# EAGLE design untitled (EAGLE 7.7.0)
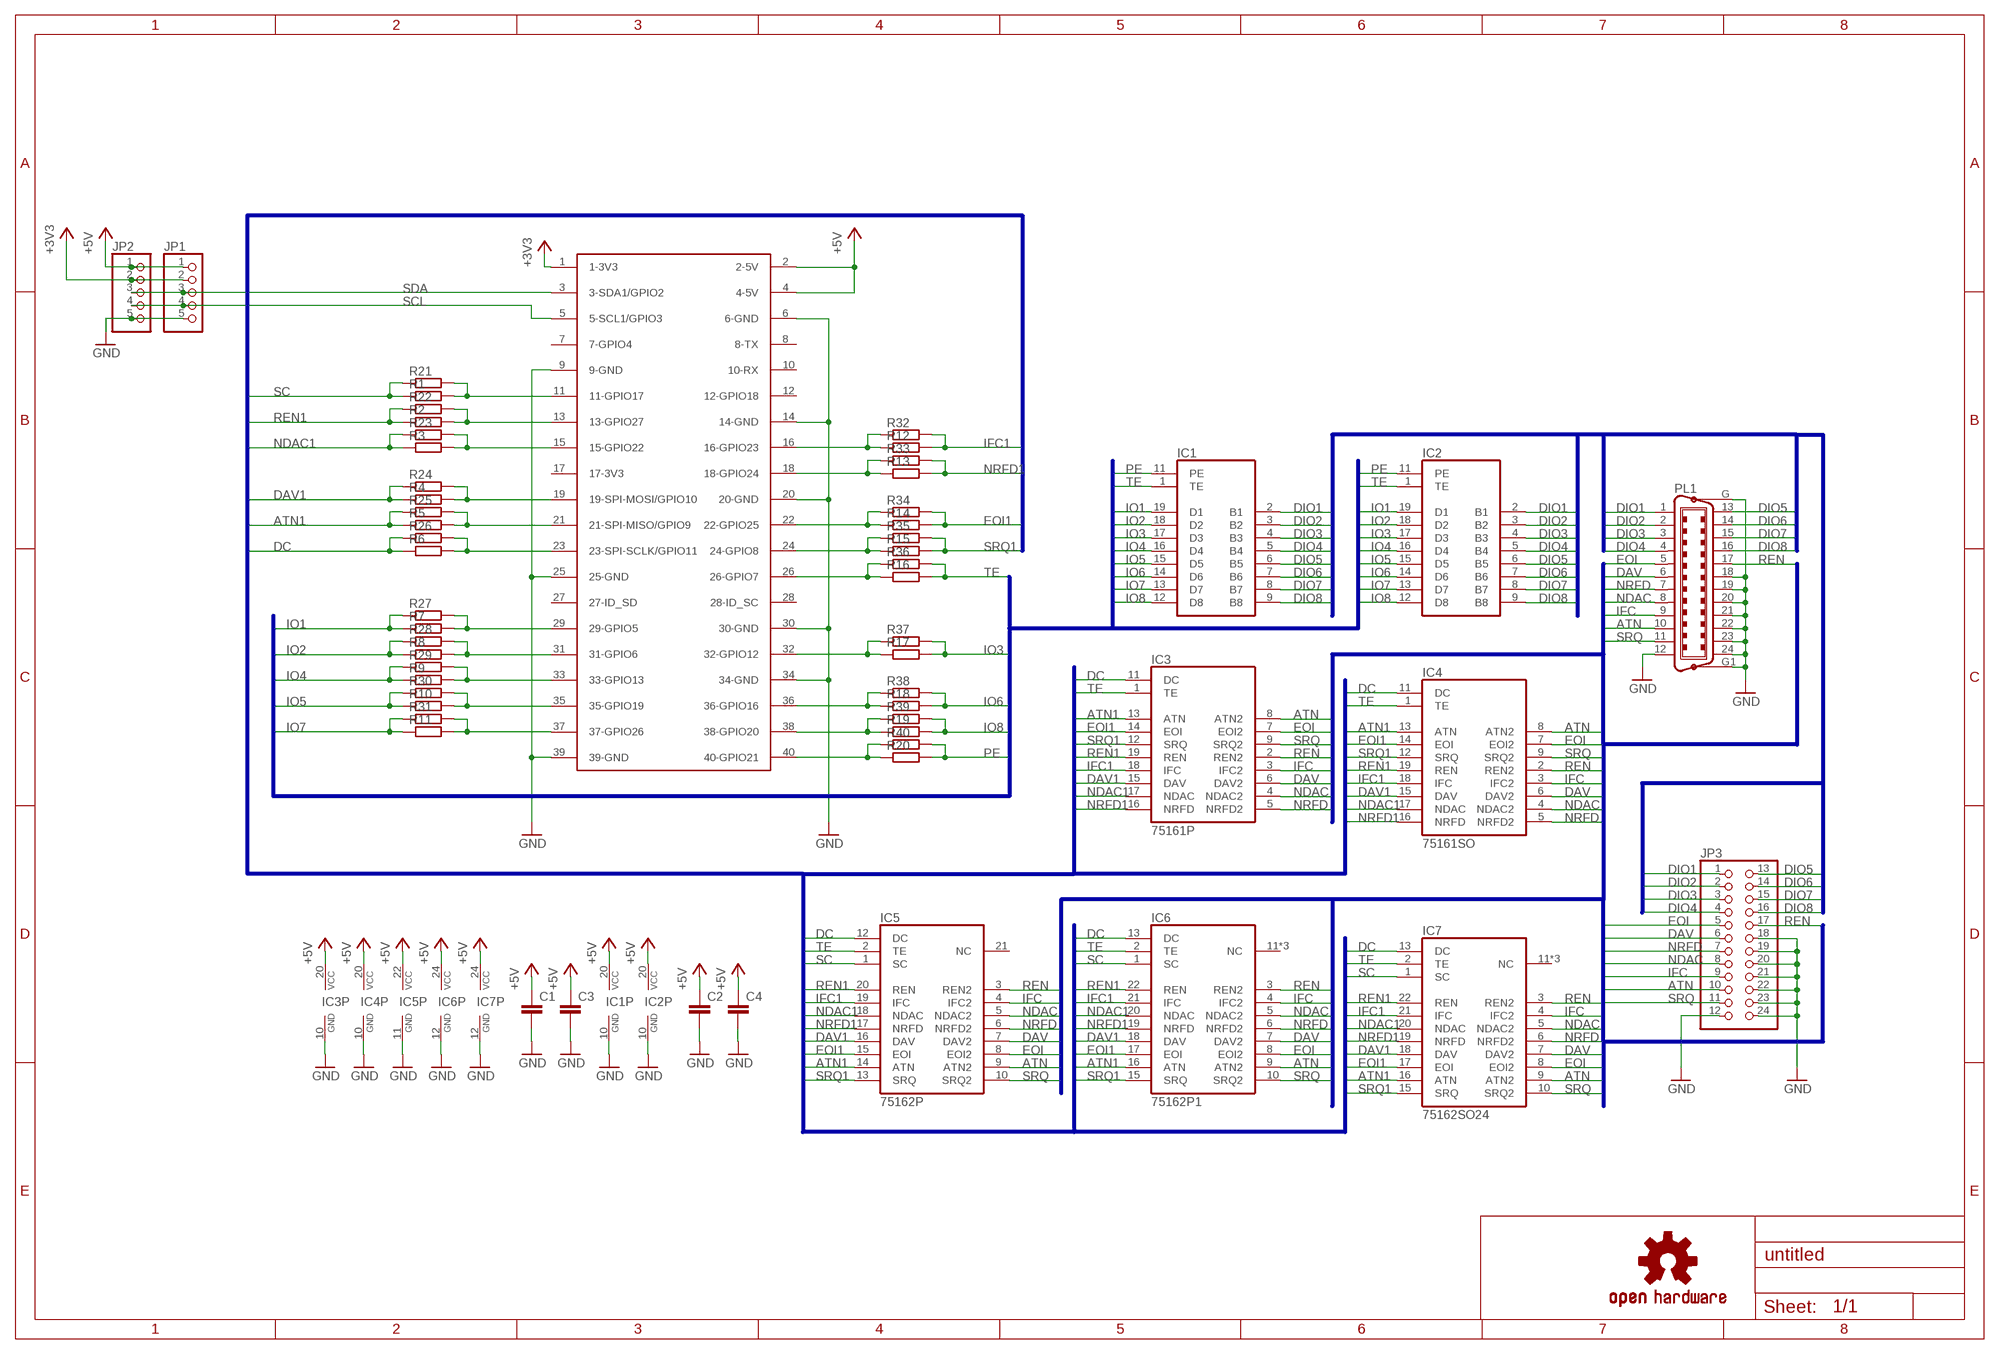
[diagram p0: schematic, sheet 1]

## Parts
C1  C-EUC0805  [C0805]
C2  C-EUC0805  [C0805]
C3  C-EU050-024X044  [C050-024X044]
C4  C-EU050-024X044  [C050-024X044]
IC1  75160P  [DIL20]
IC2  75160SO  [SO20L]
IC3  75161P  [DIL20]
IC4  75161SO  [SO20L]
IC5  75162P  [DIL22-3]
IC6  75162P1  [DIL24-3]
IC7  75162SO24  [SOIC127P1030X265-24N]
JP1  PINHD-1X5  [1X05]
JP2  PINHD-1X5  [1X05]
JP3  GPIB-PINHD-2X12  [GPIB-PINHD-2X12]
LOGO2  OSHW-LOGOS  [OSHW-LOGO-S]
PL1  C24HP  [24HP]
R1  R-EU_R0805  [R0805]
R2  R-EU_R0805  [R0805]
R3  R-EU_R0805  [R0805]
R4  R-EU_R0805  [R0805]
R5  R-EU_R0805  [R0805]
R6  R-EU_R0805  [R0805]
R7  R-EU_R0805  [R0805]
R8  R-EU_R0805  [R0805]
R9  R-EU_R0805  [R0805]
R10  R-EU_R0805  [R0805]
R11  R-EU_R0805  [R0805]
R12  R-EU_R0805  [R0805]
R13  R-EU_R0805  [R0805]
R14  R-EU_R0805  [R0805]
R15  R-EU_R0805  [R0805]
R16  R-EU_R0805  [R0805]
R17  R-EU_R0805  [R0805]
R18  R-EU_R0805  [R0805]
R19  R-EU_R0805  [R0805]
R20  R-EU_R0805  [R0805]
R21  R-EU_0204/7  [0204/7]
R22  R-EU_0204/7  [0204/7]
R23  R-EU_0204/7  [0204/7]
R24  R-EU_0204/7  [0204/7]
R25  R-EU_0204/7  [0204/7]
R26  R-EU_0204/7  [0204/7]
R27  R-EU_0204/7  [0204/7]
R28  R-EU_0204/7  [0204/7]
R29  R-EU_0204/7  [0204/7]
R30  R-EU_0204/7  [0204/7]
R31  R-EU_0204/7  [0204/7]
R32  R-EU_0204/7  [0204/7]
R33  R-EU_0204/7  [0204/7]
R34  R-EU_0204/7  [0204/7]
R35  R-EU_0204/7  [0204/7]
R36  R-EU_0204/7  [0204/7]
R37  R-EU_0204/7  [0204/7]
R38  R-EU_0204/7  [0204/7]
R39  R-EU_0204/7  [0204/7]
R40  R-EU_0204/7  [0204/7]
U$2  RASPBERRY-PI+HEADERONLY  [RASPBERRY-PI-PLUS-HEADERONLY]

## Nets
+3V3: JP1.2 JP2.2 U$2.1(1-3V3)
+5V: C1.1 C2.1 C3.1 C4.1 IC1.20(VCC) IC2.20(VCC) IC3.20(VCC) IC4.20(VCC) IC5.22(VCC) IC6.24(VCC) IC7.24(VCC) JP1.1 JP2.1 U$2.2(2-5V) U$2.4(4-5V)
ATN: IC3.8(ATN2) IC4.8(ATN2) IC5.9(ATN2) IC6.9(ATN2) IC7.9(ATN2) JP3.10 PL1.10
ATN1: IC3.13(ATN) IC4.13(ATN) IC5.14(ATN) IC6.16(ATN) IC7.16(ATN) R5.1 R25.1
DAV: IC3.6(DAV2) IC4.6(DAV2) IC5.7(DAV2) IC6.7(DAV2) IC7.7(DAV2) JP3.6 PL1.6
DAV1: IC3.15(DAV) IC4.15(DAV) IC5.16(DAV) IC6.18(DAV) IC7.18(DAV) R4.1 R24.1
DC: IC3.11(DC) IC4.11(DC) IC5.12(DC) IC6.13(DC) IC7.13(DC) R6.1 R26.1
DIO1: IC1.2(B1) IC2.2(B1) JP3.1 PL1.1
DIO2: IC1.3(B2) IC2.3(B2) JP3.2 PL1.2
DIO3: IC1.4(B3) IC2.4(B3) JP3.3 PL1.3
DIO4: IC1.5(B4) IC2.5(B4) JP3.4 PL1.4
DIO5: IC1.6(B5) IC2.6(B5) JP3.13 PL1.13
DIO6: IC1.7(B6) IC2.7(B6) JP3.14 PL1.14
DIO7: IC1.8(B7) IC2.8(B7) JP3.15 PL1.15
DIO8: IC1.9(B8) IC2.9(B8) JP3.16 PL1.16
EOI: IC3.7(EOI2) IC4.7(EOI2) IC5.8(EOI2) IC6.8(EOI2) IC7.8(EOI2) JP3.5 PL1.5
EOI1: IC3.14(EOI) IC4.14(EOI) IC5.15(EOI) IC6.17(EOI) IC7.17(EOI) R14.2 R34.2
GND: C1.2 C2.2 C3.2 C4.2 IC1.10(GND) IC2.10(GND) IC3.10(GND) IC4.10(GND) IC5.11(GND) IC6.12(GND) IC7.12(GND) JP1.5 JP2.5 JP3.12 JP3.18 JP3.19 JP3.20 JP3.21 JP3.22 JP3.23 JP3.24 PL1.12 PL1.18 PL1.19 PL1.20 PL1.21 PL1.22 PL1.23 PL1.24 PL1.G PL1.G1 U$2.6(6-GND) U$2.9(9-GND) U$2.14(14-GND) U$2.20(20-GND) U$2.25(25-GND) U$2.30(30-GND) U$2.34(34-GND) U$2.39(39-GND)
IFC: IC3.3(IFC2) IC4.3(IFC2) IC5.4(IFC2) IC6.4(IFC2) IC7.4(IFC2) JP3.9 PL1.9
IFC1: IC3.18(IFC) IC4.18(IFC) IC5.19(IFC) IC6.21(IFC) IC7.21(IFC) R12.2 R32.2
IO1: IC1.19(D1) IC2.19(D1) R7.1 R27.1
IO2: IC1.18(D2) IC2.18(D2) R8.1 R28.1
IO3: IC1.17(D3) IC2.17(D3) R17.2 R37.2
IO4: IC1.16(D4) IC2.16(D4) R9.1 R29.1
IO5: IC1.15(D5) IC2.15(D5) R10.1 R30.1
IO6: IC1.14(D6) IC2.14(D6) R18.2 R38.2
IO7: IC1.13(D7) IC2.13(D7) R11.1 R31.1
IO8: IC1.12(D8) IC2.12(D8) R19.2 R39.2
N$1: R1.2 R21.2 U$2.11(11-GPIO17)
N$2: R2.2 R22.2 U$2.13(13-GPIO27)
N$3: R3.2 R23.2 U$2.15(15-GPIO22)
N$4: R4.2 R24.2 U$2.19(19-SPI-MOSI/GPIO10)
N$5: R5.2 R25.2 U$2.21(21-SPI-MISO/GPIO9)
N$6: R6.2 R26.2 U$2.23(23-SPI-SCLK/GPIO11)
N$7: R7.2 R27.2 U$2.29(29-GPIO5)
N$8: R8.2 R28.2 U$2.31(31-GPIO6)
N$9: R9.2 R29.2 U$2.33(33-GPIO13)
N$10: R10.2 R30.2 U$2.35(35-GPIO19)
N$11: R11.2 R31.2 U$2.37(37-GPIO26)
N$12: R12.1 R32.1 U$2.16(16-GPIO23)
N$13: R13.1 R33.1 U$2.18(18-GPIO24)
N$14: R14.1 R34.1 U$2.22(22-GPIO25)
N$15: R15.1 R35.1 U$2.24(24-GPIO8)
N$16: R16.1 R36.1 U$2.26(26-GPIO7)
N$17: R17.1 R37.1 U$2.32(32-GPIO12)
N$18: R18.1 R38.1 U$2.36(36-GPIO16)
N$19: R19.1 R39.1 U$2.38(38-GPIO20)
N$20: R20.1 R40.1 U$2.40(40-GPIO21)
NDAC: IC3.4(NDAC2) IC4.4(NDAC2) IC5.5(NDAC2) IC6.5(NDAC2) IC7.5(NDAC2) JP3.8 PL1.8
NDAC1: IC3.17(NDAC) IC4.17(NDAC) IC5.18(NDAC) IC6.20(NDAC) IC7.20(NDAC) R3.1 R23.1
NRFD: IC3.5(NRFD2) IC4.5(NRFD2) IC5.6(NRFD2) IC6.6(NRFD2) IC7.6(NRFD2) JP3.7 PL1.7
NRFD1: IC3.16(NRFD) IC4.16(NRFD) IC5.17(NRFD) IC6.19(NRFD) IC7.19(NRFD) R13.2 R33.2
PE: IC1.11(PE) IC2.11(PE) R20.2 R40.2
REN: IC3.2(REN2) IC4.2(REN2) IC5.3(REN2) IC6.3(REN2) IC7.3(REN2) JP3.17 PL1.17
REN1: IC3.19(REN) IC4.19(REN) IC5.20(REN) IC6.22(REN) IC7.22(REN) R2.1 R22.1
SC: IC5.1(SC) IC6.1(SC) IC7.1(SC) R1.1 R21.1
SCL: JP1.4 JP2.4 U$2.5(5-SCL1/GPIO3)
SDA: JP1.3 JP2.3 U$2.3(3-SDA1/GPIO2)
SRQ: IC3.9(SRQ2) IC4.9(SRQ2) IC5.10(SRQ2) IC6.10(SRQ2) IC7.10(SRQ2) JP3.11 PL1.11
SRQ1: IC3.12(SRQ) IC4.12(SRQ) IC5.13(SRQ) IC6.15(SRQ) IC7.15(SRQ) R15.2 R35.2
TE: IC1.1(TE) IC2.1(TE) IC3.1(TE) IC4.1(TE) IC5.2(TE) IC6.2(TE) IC7.2(TE) R16.2 R36.2
Unconnected: IC5.21(NC) IC6.11(NC) IC6.14(NC) IC6.23(NC) IC7.11(NC) IC7.14(NC) IC7.23(NC) U$2.7(7-GPIO4) U$2.8(8-TX) U$2.10(10-RX) U$2.12(12-GPIO18) U$2.17(17-3V3) U$2.27(27-ID_SD) U$2.28(28-ID_SC)

## Buses
DIO[1..8]
CTRL:ATN,EOI,SRQ,REN,IFC,DAV,NDAC,NRFD
IO[1..8],TE,PE
CPU:ATN1,EOI1,SRQ1,REN1,IFC1,DAV1,NDAC1,NRFD1,DC,TE,SC

## Library data of the parts
C1-C4 = rcl:C-EU: CAPACITOR, European symbol
IC1 IC2 = GRiD:75160: 75xxx DEVICE
IC3 IC4 = GRiD:75161: 75xxx DEVICE
IC5-IC7 = GRiD:75162: 75xxx DEVICE
JP1 JP2 = pinhead:PINHD-1X5: PIN HEADER
JP3 = GRiD:GPIB-PINHD-2X12: PIN HEADER
LOGO2 = SparkFun-Aesthetics:OSHW-LOGO: Open-Source Hardware (OSHW) Logo This logo indicates the piece of hardware it is found on incorporates a OSHW license and/or adheres to the definition of open source hardware found here: http://freedomdefined.org/OSHW
PL1 = con-amp-champ:C24HP: CONNECTOR; OC_FARNELL: unknown; OC_NEWARK: unknown
R1-R40 = rcl:R-EU_: RESISTOR, European symbol
U$2 = Ava:RASPBERRY-PI+: Samtec SSW-120-01-T-D

## Board
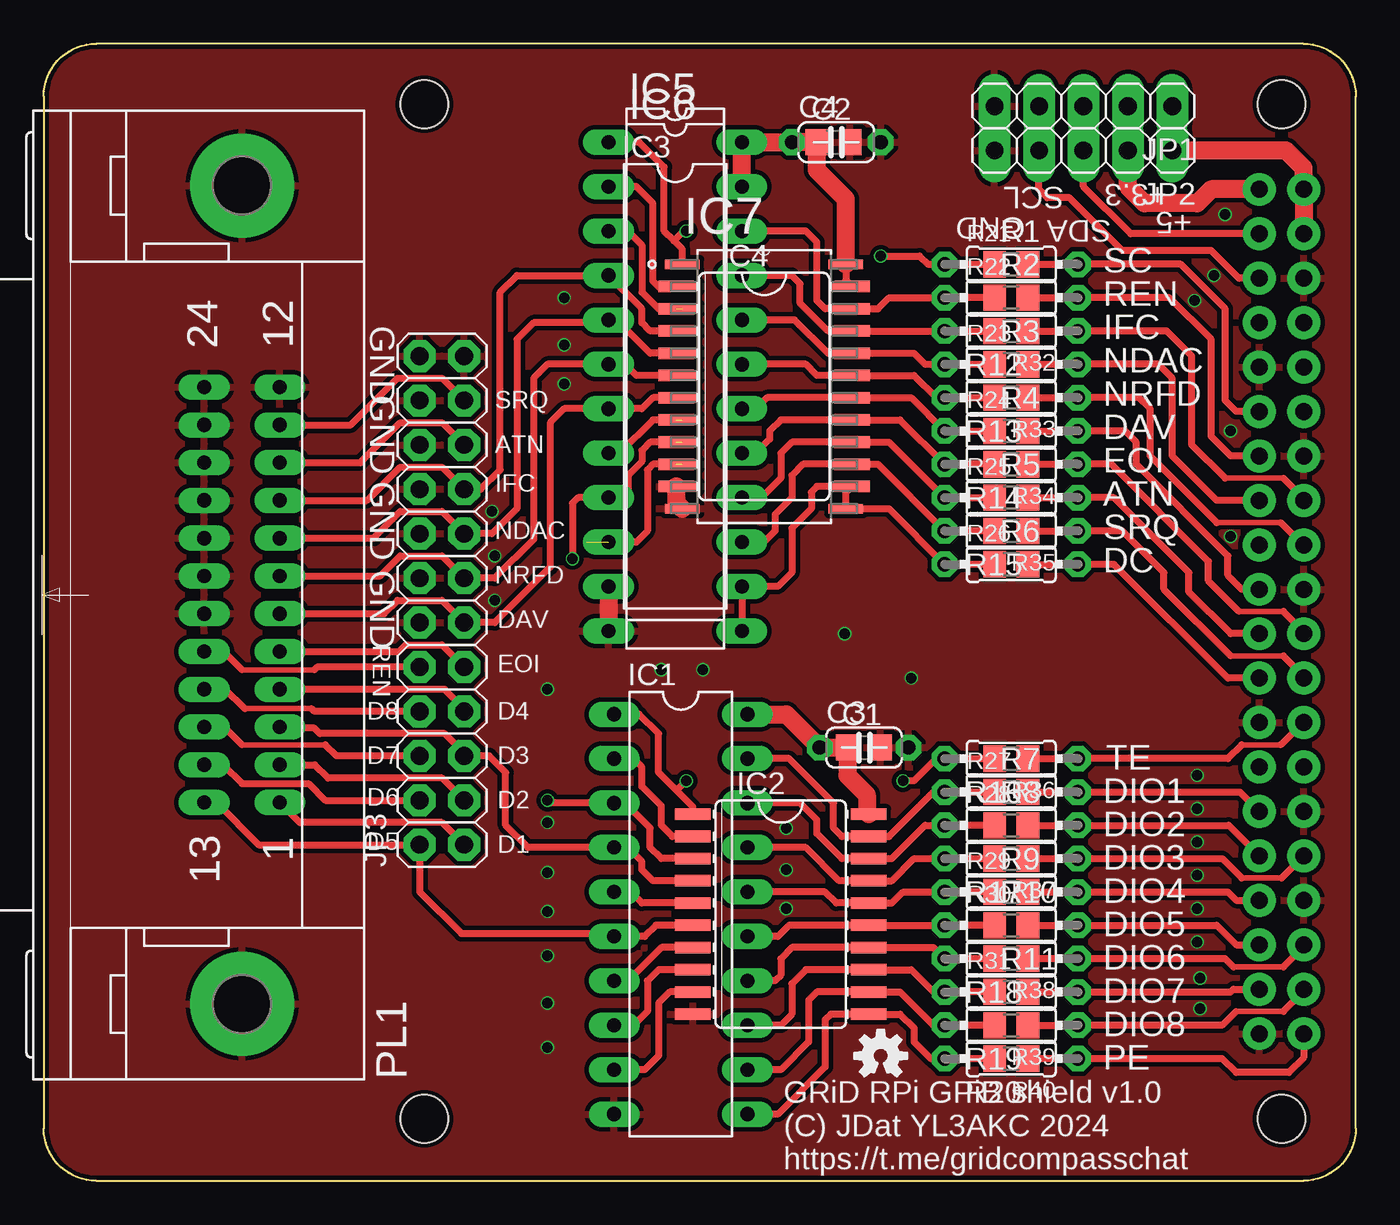
[diagram p1: board, top side]
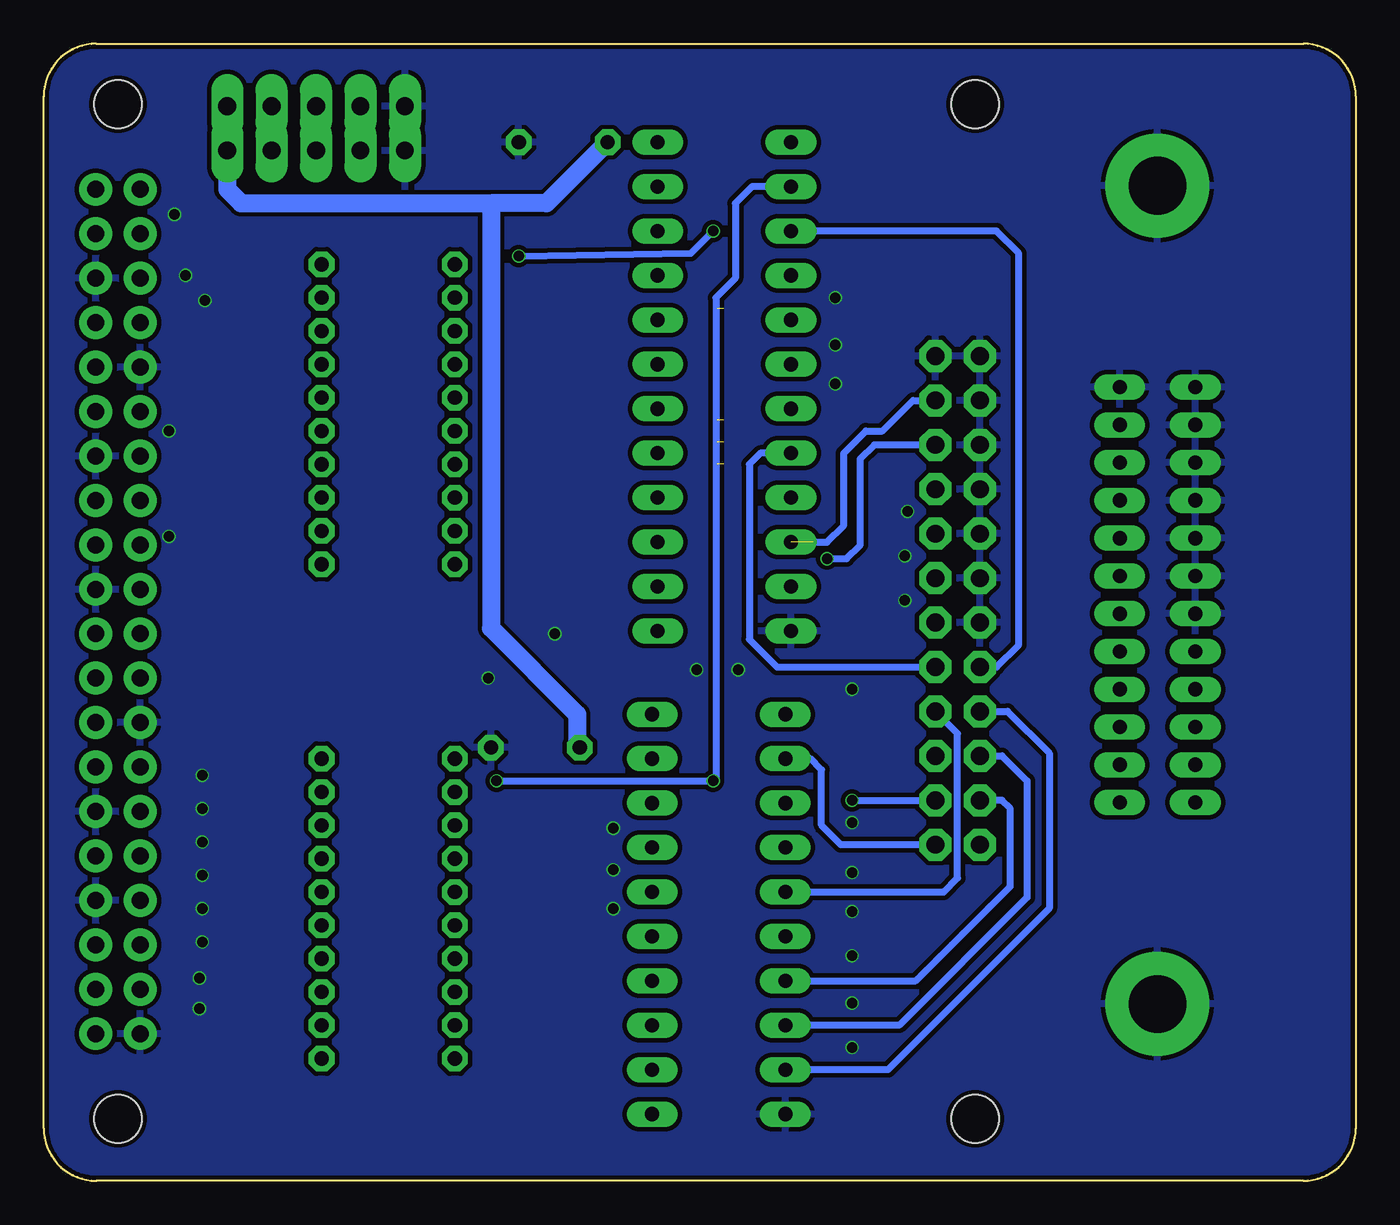
[diagram p2: board, bottom side, seen from below]

Size 75 x 65 mm. Coordinates in mm from the lower left corner, seen from the top.
Outline: 3,0 72,0 arc90 75,3 75,62 arc90 72,65 3,65 arc90 0,62 0,3 arc90 3,0
Copper layers (1*16): Top 0.035mm / dielectric 1.6mm / Bottom 0.035mm
Design rules "jlcpcb-2layers": minimum track width 5mil, minimum drill 0.3mm, track to track 5mil, track to pad 5mil, pad to pad 5mil, via to via 5mil, smd to smd 5mil, copper to edge 0.2mm, drill to drill 6mil, minimum pad ring 10mil, minimum via ring 3mil, stop-mask expansion 4mil, vias tented up to drill 0mil, thermal gap 10mil
Holes 2.75 mm at 70.76,3.54 21.76,3.54 21.76,61.54 70.76,61.54

### Footprints (pad centres in the part's own frame; a part is rotated, then mirrored left to right if it is on the bottom)
C0805 = smd 1.3 x 1.5: 1 -0.95,0; 2 0.95,0
C050-024X044 = drill 0.813 octagon: 1 -2.54,0; 2 2.54,0
DIL20 = drill 0.813 long: 1 -11.43,-3.81; 2 -8.89,-3.81; 3 -6.35,-3.81; 4 -3.81,-3.81; 5 -1.27,-3.81; 6 1.27,-3.81; 7 3.81,-3.81; 8 6.35,-3.81; 9 8.89,-3.81; 10 11.43,-3.81; 11 11.43,3.81; 12 8.89,3.81; 13 6.35,3.81; 14 3.81,3.81; 15 1.27,3.81; 16 -1.27,3.81; 17 -3.81,3.81; 18 -6.35,3.81; 19 -8.89,3.81; 20 -11.43,3.81
SO20L = smd 0.66 x 2.032: 1 -5.715,-5.029; 2 -4.445,-5.029; 3 -3.175,-5.029; 4 -1.905,-5.029; 5 -0.635,-5.029; 6 0.635,-5.029; 7 1.905,-5.029; 8 3.175,-5.029; 9 4.445,-5.029; 10 5.715,-5.029; 11 5.715,5.029; 12 4.445,5.029; 13 3.175,5.029; 14 1.905,5.029; 15 0.635,5.029; 16 -0.635,5.029; 17 -1.905,5.029; 18 -3.175,5.029; 19 -4.445,5.029; 20 -5.715,5.029
DIL22-3 = drill 0.813 long: 1 -12.7,-3.81; 2 -10.16,-3.81; 3 -7.62,-3.81; 4 -5.08,-3.81; 5 -2.54,-3.81; 6 0,-3.81; 7 2.54,-3.81; 8 5.08,-3.81; 9 7.62,-3.81; 10 10.16,-3.81; 11 12.7,-3.81; 12 12.7,3.81; 13 10.16,3.81; 14 7.62,3.81; 15 5.08,3.81; 16 2.54,3.81; 17 0,3.81; 18 -2.54,3.81; 19 -5.08,3.81; 20 -7.62,3.81; 21 -10.16,3.81; 22 -12.7,3.81
DIL24-3 = drill 0.813 long: 1 -13.97,-3.81; 2 -11.43,-3.81; 3 -8.89,-3.81; 4 -6.35,-3.81; 5 -3.81,-3.81; 6 -1.27,-3.81; 7 1.27,-3.81; 8 3.81,-3.81; 9 6.35,-3.81; 10 8.89,-3.81; 11 11.43,-3.81; 12 13.97,-3.81; 13 13.97,3.81; 14 11.43,3.81; 15 8.89,3.81; 16 6.35,3.81; 17 3.81,3.81; 18 1.27,3.81; 19 -1.27,3.81; 20 -3.81,3.81; 21 -6.35,3.81; 22 -8.89,3.81; 23 -11.43,3.81; 24 -13.97,3.81
SOIC127P1030X265-24N = smd 1.981 x 0.559: 1 -4.674,6.985; 2 -4.674,5.715; 3 -4.674,4.445; 4 -4.674,3.175; 5 -4.674,1.905; 6 -4.674,0.635; 7 -4.674,-0.635; 8 -4.674,-1.905; 9 -4.674,-3.175; 10 -4.674,-4.445; 11 -4.674,-5.715; 12 -4.674,-6.985; 13 4.674,-6.985; 14 4.674,-5.715; 15 4.674,-4.445; 16 4.674,-3.175; 17 4.674,-1.905; 18 4.674,-0.635; 19 4.674,0.635; 20 4.674,1.905; 21 4.674,3.175; 22 4.674,4.445; 23 4.674,5.715; 24 4.674,6.985
1X05 = drill 1.016 long: 1 -5.08,0; 2 -2.54,0; 3 0,0; 4 2.54,0; 5 5.08,0
GPIB-PINHD-2X12 = drill 1.016 octagon: 1 -13.97,-1.27; 2 -11.43,-1.27; 3 -8.89,-1.27; 4 -6.35,-1.27; 5 -3.81,-1.27; 6 -1.27,-1.27; 7 1.27,-1.27; 8 3.81,-1.27; 9 6.35,-1.27; 10 8.89,-1.27; 11 11.43,-1.27; 12 13.97,-1.27; 13 -13.97,1.27; 14 -11.43,1.27; 15 -8.89,1.27; 16 -6.35,1.27; 17 -3.81,1.27; 18 -1.27,1.27; 19 1.27,1.27; 20 3.81,1.27; 21 6.35,1.27; 22 8.89,1.27; 23 11.43,1.27; 24 13.97,1.27
24HP = drill 0.813 long: 1 -11.874,-2.159; 2 -9.716,-2.159; 3 -7.556,-2.159; 4 -5.397,-2.159; 5 -3.239,-2.159; 6 -1.079,-2.159; 7 1.079,-2.159; 8 3.239,-2.159; 9 5.397,-2.159; 10 7.556,-2.159; 11 9.716,-2.159; 12 11.874,-2.159; 13 -11.874,2.159; 14 -9.716,2.159; 15 -7.556,2.159; 16 -5.397,2.159; 17 -3.239,2.159; 18 -1.079,2.159; 19 1.079,2.159; 20 3.239,2.159; 21 5.397,2.159; 22 7.556,2.159; 23 9.716,2.159; 24 11.874,2.159 | drill 3.302 pad 5.842: G -23.393,0; G1 23.393,0
R0805 = smd 1.3 x 1.5: 1 -0.95,0; 2 0.95,0
0204/7 = drill 0.813 octagon: 1 -3.81,0; 2 3.81,0
RASPBERRY-PI-PLUS-HEADERONLY = drill 0.97 pad 1.88: 1 -23.97,-1.218; 2 -23.97,1.323; 3 -21.43,-1.218; 4 -21.43,1.323; 5 -18.89,-1.218; 6 -18.89,1.323; 7 -16.35,-1.218; 8 -16.35,1.323; 9 -13.81,-1.218; 10 -13.81,1.323; 11 -11.27,-1.218; 12 -11.27,1.323; 13 -8.73,-1.218; 14 -8.73,1.323; 15 -6.19,-1.218; 16 -6.19,1.323; 17 -3.65,-1.218; 18 -3.65,1.323; 19 -1.11,-1.218; 20 -1.11,1.323; 21 1.43,-1.218; 22 1.43,1.323; 23 3.97,-1.218; 24 3.97,1.323; 25 6.51,-1.218; 26 6.51,1.323; 27 9.05,-1.218; 28 9.05,1.323; 29 11.59,-1.218; 30 11.59,1.323; 31 14.13,-1.218; 32 14.14,1.323; 33 16.67,-1.218; 34 16.67,1.323; 35 19.21,-1.218; 36 19.21,1.323; 37 21.75,-1.218; 38 21.75,1.323; 39 24.29,-1.218; 40 24.29,1.323

### Placement (x,y rotation side)
C1  46.89,24.77 0 top
C2  45.15,59.37 0 top
C3  46.89,24.77 0 top
C4  45.3,59.37 0 top
IC1  36.41,15.24 270 top
IC2  42.13,15.24 270 top
IC3  36.1,45.4 270 top
IC4  41.18,45.4 270 top
IC5  36.1,46.67 270 top
IC6  36.1,45.4 270 top
IC7  41.18,45.4 0 top
JP1  59.43,61.44 180 top
JP2  59.43,58.9 180 top
JP3  22.76,33.18 90 top
LOGO2  47.84,7.14 0 top
PL1  11.33,33.5 90 top
R1  55.31,52.39 0 top
R2  55.31,50.48 0 top
R3  55.31,46.67 0 top
R4  55.31,42.86 0 top
R5  55.31,39.05 0 top
R6  55.31,35.24 0 top
R7  55.31,22.23 0 top
R8  55.31,20.32 0 top
R9  55.31,16.51 0 top
R10  55.31,14.61 0 top
R11  55.31,10.79 0 top
R12  55.31,48.58 180 top
R13  55.31,44.77 180 top
R14  55.31,40.96 180 top
R15  55.31,37.15 180 top
R16  55.31,24.13 180 top
R17  55.31,18.41 180 top
R18  55.31,12.7 180 top
R19  55.31,8.89 180 top
R20  55.31,6.99 180 top
R21  55.31,52.39 0 top
R22  55.31,50.48 0 top
R23  55.31,46.67 0 top
R24  55.31,42.86 0 top
R25  55.31,39.05 0 top
R26  55.31,35.24 0 top
R27  55.31,22.23 0 top
R28  55.31,20.32 0 top
R29  55.31,16.51 0 top
R30  55.31,14.61 0 top
R31  55.31,10.79 0 top
R32  55.31,48.58 180 top
R33  55.31,44.77 180 top
R34  55.31,40.96 180 top
R35  55.31,37.15 180 top
R36  55.31,24.13 180 top
R37  55.31,18.41 180 top
R38  55.31,12.7 180 top
R39  55.31,8.89 180 top
R40  55.31,6.99 180 top
U$2  70.7,32.7 270 top

### Tracks (layer width: path | path; a pad name or v marks a point on that pad's centre or on a via)
+3V3
  Top 1.016: JP1.2 JP2.2 61.97,56.83 62.93,55.88 65.94,55.88 66.73,56.67 U$2.1
+5V
  Top 0.406: IC7.24 45.85,51.47 IC4.20
  Top 1.016: IC3.20 IC6.24 C4.1 C2.1 44.19,57.78 45.85,56.13 IC7.24 | JP1.1 JP2.1 71.02,58.9 72.03,57.89 U$2.2 U$2.4 | IC1.20 42.45,26.67 C3.1 C1.1 45.94,23.18 47.05,22.07 47.05,21.06 IC2.20
  Bottom 1.016: JP2.1 64.51,56.67 63.72,55.88 49.43,55.88 | C4.1 46.26,55.88 49.43,55.88 | 49.43,55.88 49.43,31.59 44.51,26.67 44.51,24.92 C3.1
ATN  (via drill 0.6)  (1 unrouted)
  Top 0.406: PL1.10 18.09,41.05 20.38,43.34 22.76,43.34 JP3.10 | IC4.8 34.67,42.23 34.19,41.75 34.19,41.12 33.4,40.32 33.4,39.53 32.92,39.05 IC6.9 30.54,39.05 30.22,38.73 v30.22,35.56
  Bottom 0.406: v30.22,35.56 29.11,35.56 28.32,36.35 28.32,41.27 27.52,42.07 JP3.10
ATN1
  Top 0.406: IC5.14 41.02,39.05 42.13,40.16 42.13,41.59 42.77,42.23 IC7.16 IC4.13 48.32,42.23 R25.1 R5.1
DAV
  Top 0.406: PL1.6 19.46,32.42 20.22,33.18 22.76,33.18 JP3.6 25.78,31.91 28.95,35.08 28.95,43.34 29.75,44.13 IC6.7 34.19,44.13 34.83,44.77 IC4.6 IC7.7
DAV1
  Top 0.406: IC5.16 40.7,44.13 41.34,44.77 IC7.18 IC4.15 49.59,44.77 R24.1 R4.1
DC
  Top 0.406: IC6.13 IC5.12 41.97,33.97 42.77,34.77 42.77,37.31 43.88,38.42 43.88,39.37 44.19,39.69 IC4.11 45.85,39.33 IC7.13 48.32,38.42 R26.1 R6.1
DIO1
  Top 0.406: JP3.1 22.76,20.48 14.63,20.48 PL1.1 | IC2.2 35.94,19.68 35.3,20.32 35.3,21.43 34.19,22.54 34.19,23.65 33.72,24.13 IC1.2
  Bottom 0.406: 33.24,24.13 IC1.2 31.18,24.13 30.54,23.5 30.54,20.32 29.43,19.21 JP3.1
DIO2  (via drill 0.6)
  Top 0.406: PL1.2 15.49,23.78 16.25,23.02 22.76,23.02 JP3.2 | IC2.3 35.3,18.41 34.67,19.05 34.67,20.16 33.24,21.59 IC1.3 28.95,21.59 v28.8,21.75
  Bottom 0.406: v28.8,21.75 JP3.2
DIO3
  Top 0.406: PL1.3 13.55,25.88 15.46,25.88 15.78,25.56 22.92,25.56 24.03,24.45 JP3.3 25.46,24.29 26.41,23.34 26.41,20.32 27.68,19.05 IC1.4 33.4,19.05 34.19,18.26 34.19,17.78 34.83,17.14 IC2.4
DIO4
  Top 0.406: JP3.4 24.03,26.99 22.92,28.1 PL1.4 | IC2.5 34.19,15.88 33.56,16.51 IC1.5
  Bottom 0.406: IC1.5 23.56,16.51 22.76,17.3 22.76,25.56 JP3.4
DIO5
  Top 0.406: PL1.13 9.87,21.62 12.29,19.21 JP3.13 21.49,16.51 23.87,14.13 32.45,14.13 IC1.6 34.35,13.97 34.99,14.61 IC2.6
DIO6
  Top 0.406: PL1.14 10.25,23.78 11.33,22.7 15.14,22.7 16.09,21.75 JP3.14 | IC2.7 35.3,13.34 33.4,11.43 IC1.7
  Bottom 0.406: IC1.7 25.14,11.43 19.75,16.83 19.75,21.27 20.22,21.75 JP3.14
DIO7
  Top 0.305: 16.09,24.92 11.33,24.92
  Top 0.406: JP3.15 16.73,24.29 16.09,24.92 | PL1.15 10.32,25.94 11.33,24.92 | IC2.8 35.14,12.06 34.51,11.43 34.51,9.68 33.72,8.89 IC1.8
  Bottom 0.406: JP3.15 20.22,24.29 18.79,22.86 18.79,16.19 26.1,8.89 IC1.8 33.24,8.89
DIO8
  Top 0.305: 15.3,26.99 11.49,26.99
  Top 0.406: JP3.16 15.46,26.83 15.3,26.99 | 11.49,26.99 10.38,28.1 PL1.16 | IC2.9 35.78,10.79 35.14,10.16 35.14,7.14 34.35,6.35 IC1.9
  Bottom 0.406: JP3.16 19.91,26.83 17.52,24.45 17.52,15.56 26.73,6.35 IC1.9
EOI  (1 unrouted)
  Top 0.406: PL1.5 20.32,30.26 20.7,30.64 22.76,30.64 JP3.5 | IC4.7 34.83,43.5 32.92,41.59 IC6.8
  Bottom 0.406: IC6.8 34.03,41.59 34.67,40.96 34.67,30.96 33.08,29.37 JP3.5
EOI1
  Top 0.406: IC5.15 40.7,41.59 41.5,42.39 41.5,42.86 42.13,43.5 IC7.17 IC4.14 48.96,43.5 R34.2 R14.2
GND  (via drill 0.6)
  Top 1.016: IC5.11 IC6.12 | IC4.10 36.15,38.77 IC7.12
  other vias: 42.45,20.16 42.45,17.78 42.45,15.56 49.59,28.73 45.78,31.27 37.69,29.21 35.3,29.21 28.8,15.4 28.8,12.86 28.8,10.16 28.8,7.62 29.75,50.48 29.75,45.56 29.75,47.78 28.8,17.62 28.8,20.48 28.8,28.1 25.78,33.18 25.78,35.72 25.62,38.26 65.94,23.18 65.94,21.27 65.94,19.37 65.94,17.46 65.94,15.56 65.94,13.65 66.1,11.59 66.1,9.84 67.53,55.24 66.9,51.75 65.78,50.32 67.85,42.86 67.85,36.83
  pour Top (isolate 0.254): -0.26,-0.16 75.15,-0.16 75.15,65.09 -0.26,65.25
  pour Bottom (isolate 0.254): -0.73,-0.64 75.63,-0.64 75.63,65.56 -0.73,65.72
IFC
  Top 0.406: PL1.9 18.48,38.89 20.38,40.8 22.76,40.8 JP3.9 24.98,39.53 26.1,40.64 26.1,50.8 27.05,51.75 IC6.4 34.19,49.85 34.19,49.05 34.67,48.58 IC4.3 IC7.4
IFC1
  Top 0.406: IC5.19 42.77,51.75 43.24,51.28 43.24,50.16 44.83,48.58 IC7.21 IC4.18 R32.2 R12.2
IO1
  Top 0.406: IC1.19 42.61,24.13 45.15,21.59 45.15,20.16 45.62,19.68 IC2.19 48.32,19.68 50.86,22.23 R27.1 R7.1
IO2
  Top 0.406: IC1.18 43.24,21.59 44.19,20.64 44.19,19.84 45.62,18.41 IC2.18 48.48,18.41 50.38,20.32 R28.1 R8.1
IO3
  Top 0.406: IC1.17 43.56,19.05 45.46,17.14 IC2.17 48.48,17.14 49.75,18.41 R37.2 R17.2
IO4
  Top 0.406: IC1.16 44.67,16.51 45.3,15.88 IC2.16 48.48,15.88 49.11,16.51 R29.1 R9.1
IO5
  Top 0.406: IC1.15 41.97,13.97 42.61,14.61 IC2.15 R30.1 R10.1
IO6
  Top 0.406: IC1.14 41.81,11.43 42.13,11.75 42.13,12.7 42.77,13.34 IC2.14 50.86,13.34 R38.2 R18.2
IO7
  Top 0.406: IC1.13 42.13,8.89 42.77,9.53 42.77,11.27 43.56,12.06 IC2.13 49.59,12.06 50.86,10.79 R31.1 R11.1
IO8
  Top 0.406: IC1.12 42.13,6.35 43.72,7.94 43.72,10.32 44.19,10.79 IC2.12 48.96,10.79 50.86,8.89 R39.2 R19.2
N$1
  Top 0.406: R1.2 R21.2 64.99,52.39 67.53,49.85 67.53,44.61 68.17,43.97 U$2.11
N$2
  Top 0.406: R2.2 R22.2 64.35,50.48 66.74,48.1 66.74,42.55 67.85,41.43 U$2.13
N$3
  Top 0.406: R3.2 R23.2 63.72,46.67 64.51,45.88 64.51,41.43 67.06,38.89 U$2.15
N$4
  Top 0.406: R4.2 R24.2 61.81,42.86 62.45,42.23 62.45,40.96 67.69,35.72 67.69,34.61 68.48,33.81 U$2.19
N$5
  Top 0.406: R5.2 R25.2 61.18,39.05 65.47,34.77 65.47,33.66 67.85,31.27 U$2.21
N$6
  Top 0.406: R6.2 R26.2 61.18,35.24 67.69,28.73 U$2.23
N$7
  Top 0.406: R7.2 R27.2 68.38,22.23 U$2.29
N$8
  Top 0.406: R8.2 R28.2 67.74,20.32 U$2.31
N$9
  Top 0.406: R9.2 R29.2 67.69,16.51 68.16,16.03 U$2.33
N$10
  Top 0.406: R10.2 R30.2 67.05,14.61 68.16,13.49 U$2.35
N$11
  Top 0.406: R11.2 R31.2 67.85,10.79 68.01,10.95 U$2.37
N$12
  Top 0.305: 70.86,40.16 67.53,40.16
  Top 0.406: R12.1 R32.1 64.2,48.58 65.62,47.15 65.62,42.07 67.53,40.16 | U$2.16 72.03,39 70.86,40.16
N$13
  Top 0.305: 70.7,37.62 67.05,37.62
  Top 0.406: R13.1 R33.1 62.61,44.77 63.24,44.13 63.24,41.43 67.05,37.62 | U$2.18 71.98,36.35 70.7,37.62
N$14
  Top 0.305: 70.86,32.54 68.32,32.54
  Top 0.406: R14.1 R34.1 61.02,40.96 66.58,35.4 66.58,34.29 68.32,32.54 | U$2.22 72.03,31.38 70.86,32.54
N$15
  Top 0.305: 70.86,30 67.85,30
  Top 0.406: R15.1 R35.1 61.66,37.15 64.04,34.77 64.04,33.81 67.85,30 | U$2.24 72.03,28.84 70.86,30
N$16
  Top 0.305: 70.7,24.92 68.48,24.92
  Top 0.406: R16.1 R36.1 67.69,24.13 68.48,24.92 | U$2.26 71.97,26.19 70.7,24.92
N$17
  Top 0.305: 68.48,17.3 70.77,17.3
  Top 0.406: R17.1 R37.1 67.37,18.41 68.48,17.3 | 70.77,17.3 U$2.32
N$18
  Top 0.305: 70.86,12.22 68.01,12.22
  Top 0.406: R18.1 R38.1 67.53,12.7 68.01,12.22 | U$2.36 72.03,13.39 70.86,12.22
N$19
  Top 0.305: 70.86,9.68 68.16,9.68
  Top 0.406: R19.1 R39.1 67.37,8.89 68.16,9.68 | U$2.38 72.03,10.85 70.86,9.68
N$20
  Top 0.406: R20.1 R40.1 67.37,6.99 68.16,6.19 71.18,6.19 72.03,7.04 U$2.40
NDAC
  Top 0.406: PL1.8 18.86,36.73 20.38,38.26 22.76,38.26 JP3.8 25.62,36.99 27.05,38.42 27.05,48.1 28,49.05 32.45,49.05 | 32.45,49.05 32.92,49.05 34.67,47.31 IC4.4 IC7.5 | 32.45,49.05 IC6.5
NDAC1
  Top 0.406: IC5.18 42.92,49.21 44.83,47.31 IC7.20 IC4.17 49.75,47.31 50.38,46.67 R23.1 R3.1
NRFD
  Top 0.406: PL1.7 19.24,34.58 20.38,35.72 22.76,35.72 JP3.7 25.78,34.45 28,36.67 28,45.88 28.8,46.67 IC6.6 33.24,46.67 33.88,46.04 IC4.5 IC7.6
NRFD1
  Top 0.406: IC5.17 43.56,46.67 44.19,46.04 IC7.19 IC4.16 49.75,46.04 51.02,44.77 R33.2 R13.2
PE
  Top 0.406: IC1.11 41.97,3.81 44.67,6.51 44.67,9.21 44.99,9.53 IC2.11 48.96,9.53 49.75,8.73 49.75,7.94 50.7,6.99 R40.2 R20.2
REN  (1 unrouted)
  Top 0.305: 15.46,29.21 11.33,29.21
  Top 0.406: JP3.17 15.62,29.37 15.46,29.21 | 11.33,29.21 10.29,30.26 PL1.17 | IC6.3 33.4,54.29 34.19,53.5 34.19,50.8 35.14,49.85 IC4.2
  Bottom 0.406: JP3.17 20.54,29.37 19.27,30.64 19.27,53.02 20.54,54.29 IC6.3
REN1
  Top 0.406: IC5.20 43.56,54.29 44.19,53.66 44.19,50.32 44.67,49.85 IC7.22 IC4.19 47.69,49.85 48.32,50.48 R22.1 R2.1
SC  (via drill 0.6)
  Top 0.406: IC7.1 36.5,53.25 36.02,53.74 | 36.02,53.74 35.46,54.29 35.46,57.94 34.03,59.37 IC5.1 | v36.73,54.29 36.57,54.29 36.02,53.74 | v47.84,52.86 50.07,52.86 50.54,52.39 R21.1 R1.1
  Bottom 0.406: v47.84,52.86 38,53.02 v36.73,54.29
SCL
  Top 0.406: U$2.5 68.33,51.59 66.74,53.18 61.66,53.18 58.64,56.2 57.37,56.2 56.89,56.67 JP2.4
  Top 1.016: JP2.4 JP1.4
SDA
  Top 0.406: U$2.3 62.13,54.13 59.43,56.83 JP2.3
  Top 1.016: JP2.3 JP1.3
SRQ  (2 unrouted)
  Top 0.406: PL1.11 17.55,43.21 20.22,45.88 22.76,45.88 JP3.11 | IC4.9 34.83,40.96 34.51,40.64 34.51,37.15 33.88,36.51 IC6.10
  Bottom 0.406: 31.02,36.51 30.22,36.51 29.27,37.47 29.27,41.59 28,42.86 27.05,42.86 25.3,44.61 JP3.11
SRQ1
  Top 0.406: IC5.13 41.18,36.51 41.81,37.15 41.81,38.1 42.77,39.05 42.77,40.32 43.4,40.96 IC7.15 IC4.12 47.69,40.96 R35.2 R15.2
TE  (via drill 0.6)
  Top 0.406: IC2.1 37.1,21.38 36.18,22.3 | 36.18,22.3 35.14,23.34 35.14,25.56 34.03,26.67 IC1.1 | v36.73,22.86 36.18,22.3 | IC5.2 33.88,56.83 34.83,55.88 34.83,51.44 35.22,51.04 36.02,51.04 36.1,51.12 IC7.2 IC4.1 | R16.2 R36.2 51.02,24.13 49.75,22.86 v49.11,22.86
  Bottom 0.406: v49.11,22.86 v36.73,22.86 36.57,23.02 36.57,50.48 35.46,51.59 35.46,55.88 34.51,56.83 IC5.2

### Text on the board
tSilkText: SCL | +3.3 | GND | SDA | +5 | SC | REN | GND | IFC | NDAC | GND | SRQ | NRFD | ATN | DAV | GND | EOI | IFC | ATN | NDAC | SRQ | GND | DC | NRFD | DAV | REN | EOI | D8 | D4 | D7 | D3 | TE | DIO1 | D6 | D2 | DIO2 | D5 | D1 | DIO3 | DIO4 | DIO5 | DIO6 | DIO7 | DIO8 | PE | GRiD RPi GPiB shield v1.0 / (C) JDat YL3AKC 2024 / https://t.me/gridcompasschat